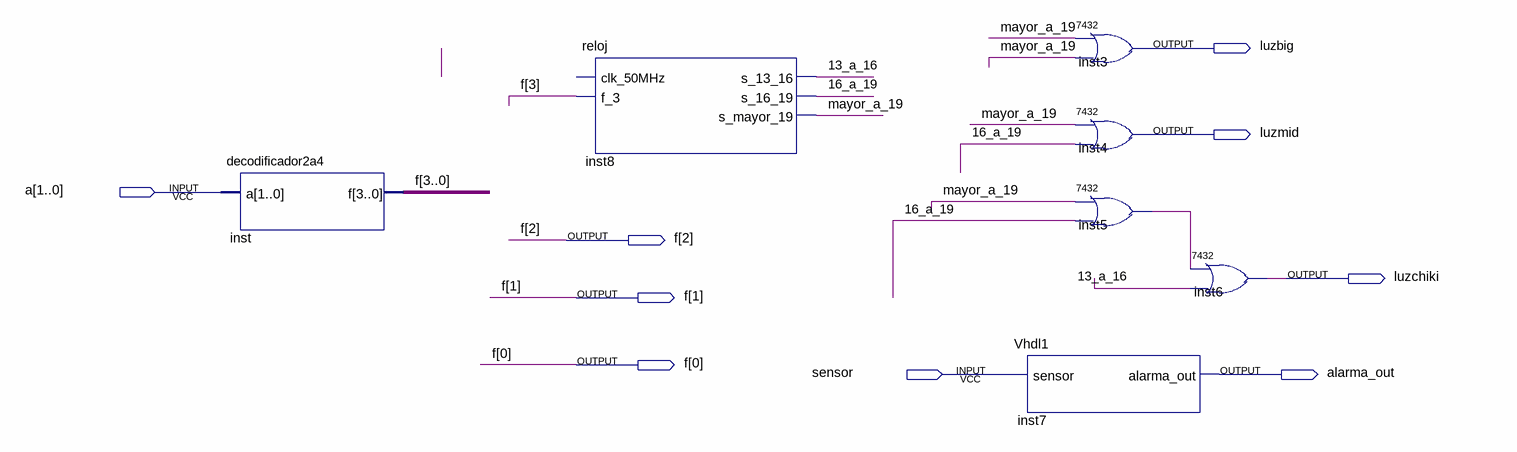
[diagram p0: schematic sheet]
// Quartus schematic sistemasluzseguridad.bdf as structural Verilog: 7 symbols, 9 pins
module sistemasluzseguridad (
  input  [1:0] a,
  input  sensor,
  output luzbig,
  output luzmid,
  output [3:0] f,
  output luzchiki,
  output alarma_out
);

  wire \13_a_16 , \16_a_19 , inst5_1, mayor_a_19;

  decodificador2a4 inst (.a(a), .f(f));
  reloj inst8 (.f_3(f[3]), .s_13_16(\13_a_16 ), .s_16_19(\16_a_19 ), .s_mayor_19(mayor_a_19));  // open: clk_50MHz
  Vhdl1 inst7 (.sensor(sensor), .alarma_out(alarma_out));
  \7432  inst3 (.\2 (mayor_a_19), .\3 (mayor_a_19), .\1 (luzbig));
  \7432  inst4 (.\2 (mayor_a_19), .\3 (\16_a_19 ), .\1 (luzmid));
  \7432  inst5 (.\2 (mayor_a_19), .\3 (\16_a_19 ), .\1 (inst5_1));
  \7432  inst6 (.\2 (inst5_1), .\3 (\13_a_16 ), .\1 (luzchiki));
endmodule
